# Altium schematic sheet Front-end.SchDoc
size A4
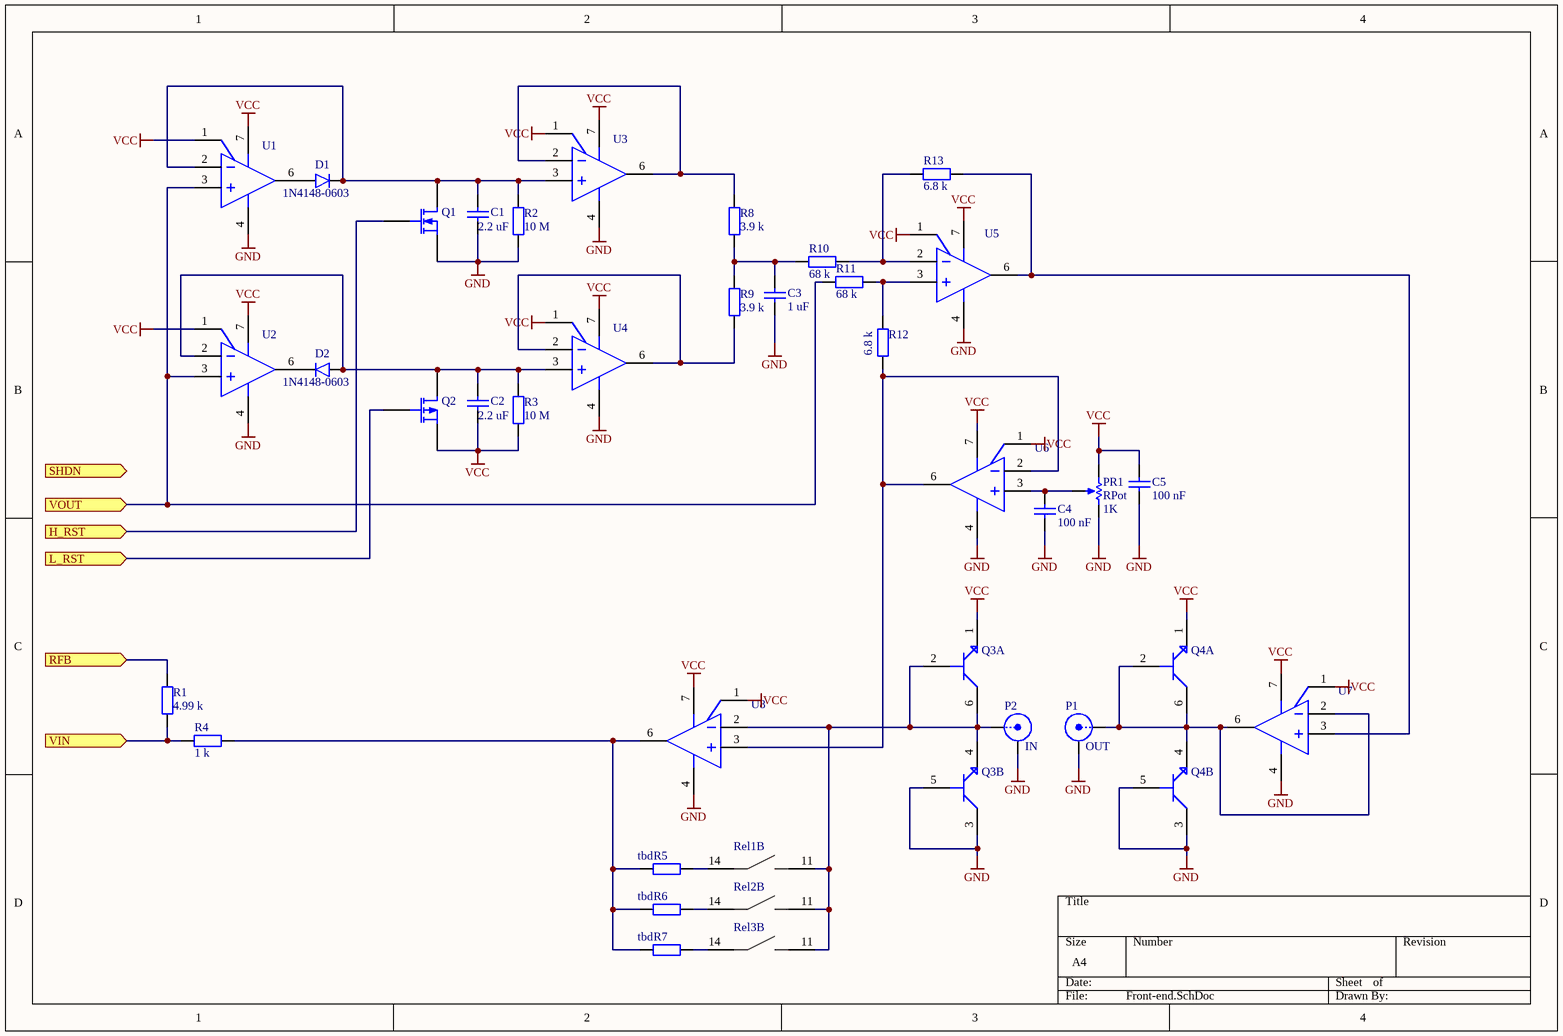
[diagram p0: Front-end.SchDoc]

## Parts
C1  2.2 uF  [C1206]
C2  2.2 uF  [C1206]
C3  1 uF  [C1206]
C4  100 nF  [C1206]
C5  100 nF  [C1206]
D1  1N4148-0603  [C1206]
D2  1N4148-0603  [C1206]
P1  OUT  [BNC_RA]
P2  IN  [BNC_RA]
PR1  RPot  value 1K  [TrimmPot]
Q1  MOSFET-N  [E3]  (value not drawn)
Q2  MOSFET-P  [E3]  (value not drawn)
Q3  MBT3904DW1T1G  (value not drawn)  (parts A,B of 2)
Q4  MBT3904DW1T1G  (value not drawn)  (parts A,B of 2)
R1  4.99 k  [R1206]
R2  10 M  [R1206]
R3  10 M  [R1206]
R4  1 k  [R1206]
R5  tbd  [R1206]
R6  tbd  [R1206]
R7  tbd  [R1206]
R8  3.9 k  [R1206]
R9  3.9 k  [R1206]
R10  68 k  [R1206]
R11  68 k  [R1206]
R12  6.8 k  [R1206]
R13  6.8 k  [R1206]
Rel1  RM45N-3021-85-xxxx  [RM45N-3021-85-xxxx]  (value not drawn)  (part B of 2)
Rel2  RM45N-3021-85-xxxx  [RM45N-3021-85-xxxx]  (value not drawn)  (part B of 2)
Rel3  RM45N-3021-85-xxxx  [RM45N-3021-85-xxxx]  (value not drawn)  (part B of 2)
U1  MAX4238  [NSO8_L]  (value not drawn)
U2  MAX4238  [NSO8_L]  (value not drawn)
U3  MAX4238  [NSO8_L]  (value not drawn)
U4  MAX4238  [NSO8_L]  (value not drawn)
U5  MAX4238  [NSO8_L]  (value not drawn)
U6  MAX4238  [NSO8_L]  (value not drawn)
U7  MAX4238  [NSO8_L]  (value not drawn)
U8  MAX4238  [NSO8_L]  (value not drawn)

## Ports
H_RST, L_RST, RFB, SHDN, VIN, VOUT

## Nets
GND: C1.1 C3.1 C4.1 C5.1 P1.2(Y) P2.2(Y) PR1.2(BOT) Q1.3(S) Q3.3 Q3.5 Q4.3 Q4.5 R2.1 U1.4 U2.4 U3.4 U4.4 U5.4 U6.4 U7.4 U8.4
VCC: C2.1 C5.2 PR1.1(TOP) Q2.3(S) Q3.1 Q4.1 R3.1 U1.1(SHDN) U1.7 U2.1(SHDN) U2.7 U3.1(SHDN) U3.7 U4.1(SHDN) U4.7 U5.1(SHDN) U5.7 U6.1(SHDN) U6.7 U7.1(SHDN) U7.7 U8.1(SHDN) U8.7
H_RST: Q1.2(G) ; port H_RST
L_RST: Q2.2(G) ; port L_RST
RFB: R1.2 ; port RFB
VIN: R1.1 R4.2 ; port VIN
VOUT: R11.2 U1.3(+) U2.3(+) ; port VOUT
NetC1_2: C1.2 D1.1 Q1.1(D) R2.2 U1.2(-) U3.3(+)
NetC2_2: C2.2 D2.2 Q2.1(D) R3.2 U2.2(-) U4.3(+)
NetC3_2: C3.2 R8.1 R9.2 R10.2
NetC4_2: C4.2 PR1.3(TAP) U6.3(+)
NetD1_2: D1.2 U1.6
NetD2_1: D2.1 U2.6
NetP1_1: P1.1(X) Q4.2 Q4.4 Q4.6 U7.2(-) U7.6
NetP2_1: P2.1(X) Q3.2 Q3.4 Q3.6 Rel1.11(SW) Rel2.11(SW) Rel3.11(SW) U8.2(-)
NetR4_1: R4.1 R5.2 R6.2 R7.2 U8.6
NetR5_1: R5.1 Rel1.14(SW)
NetR6_1: R6.1 Rel2.14(SW)
NetR7_1: R7.1 Rel3.14(SW)
NetR8_2: R8.2 U3.2(-) U3.6
NetR9_1: R9.1 U4.2(-) U4.6
NetR10_1: R10.1 R13.2 U5.2(-)
NetR11_1: R11.1 R12.1 U5.3(+)
NetR12_2: R12.2 U6.2(-) U6.6 U8.3(+)
NetR13_1: R13.1 U5.6 U7.3(+)

## Library data of the parts
C1 C2 = Cap Semi: Capacitor (Semiconductor SIM Model); Value: 2u2; Published: 8-Jun-2000; LatestRevisionDate: 29-May-2009; LatestRevisionNote: IPC-7351 Footprint Added.; PackageReference: C1206; Publisher: Altium Limited; PackageDescription: Chip Capacitor
C3 = Cap Semi: Capacitor (Semiconductor SIM Model); Value: 1u; Published: 8-Jun-2000; LatestRevisionDate: 29-May-2009; LatestRevisionNote: IPC-7351 Footprint Added.; PackageReference: C1206; Publisher: Altium Limited; PackageDescription: Chip Capacitor
C4 C5 = Cap Semi: Capacitor (Semiconductor SIM Model); Value: 100n; Published: 8-Jun-2000; LatestRevisionDate: 29-May-2009; LatestRevisionNote: IPC-7351 Footprint Added.; PackageReference: C1206; Publisher: Altium Limited; PackageDescription: Chip Capacitor
D1 D2 = 1N4148: Dioda: przełączająca; SMD; 100V; 150mA; 4ns; 0603; Manufacture: DC COMPONENTS; Shop1: TME; DafaultFootprint: 0603; Value1: 75V; Parameter1: Vr; Parameter2: If; ComponentLink1URL: http://www.tme.eu/pl/Document/56f18f971963fb7c3e40973a6fd3d82c/CD4148W_WT.pdf; ComponentLink2URL: *; ComponentLink1Description: Datasheet; ComponentLink2Description: *; Tolerance1: *; Shop1ID: *; ComponentType: Diod Rectifier; Assembly: SMD; Replacement: *; ComponentSymbol: 1N4148-0603; Value2: 150mA
P1 P2 = BNC: BNC Elbow Connector; LatestRevisionDate: 17-Jul-2002; LatestRevisionNote: Re-released for DXP Platform.; Publisher: Altium Limited
PR1 = RPot: Potentiometer; Sim Note: Enter the Resistance value and the set point into parameter fields.; Set Position: 0.5; Published: 8-Jun-2000; LatestRevisionDate: 17-Jul-2002; LatestRevisionNote: Re-released for DXP Platform.; PackageReference: VR5; Publisher: Altium Limited; PackageDescription: Variable Resistor, Thru-Hole; 3 Leads
Q1 = MOSFET-N: N-Channel MOSFET; Published: 8-Jun-2000; LatestRevisionDate: 17-Jul-2002; LatestRevisionNote: Re-released for DXP Platform.; PackageVersion: 1995/1996; PackageReference: E3; Publisher: Altium Limited; PackageDescription: TO, Flat Index; 3 In-Line, Axial Leads; Body Dia. 4.6mm; Lead Dia. 0.5 mm (max)
Q2 = MOSFET-P: P-Channel MOSFET; Published: 8-Jun-2000; LatestRevisionDate: 17-Jul-2002; LatestRevisionNote: Re-released for DXP Platform.; PackageVersion: 1995/1996; PackageReference: E3; Publisher: Altium Limited; PackageDescription: TO, Flat Index; 3 In-Line, Axial Leads; Body Dia. 4.6mm; Lead Dia. 0.5 mm (max)
R1 = Res2: Resistor; Value: 4k99; Published: 8-Jun-2000; LatestRevisionDate: 17-Jul-2002; LatestRevisionNote: Re-released for DXP Platform.; PackageReference: AXIAL-0.4; Publisher: Altium Limited; PackageDescription: Axial Device, Thru-Hole; 2 Leads; 0.4 in Pin Spacing
R2 R3 = Res2: Resistor; Value: 10M; Published: 8-Jun-2000; LatestRevisionDate: 17-Jul-2002; LatestRevisionNote: Re-released for DXP Platform.; PackageReference: AXIAL-0.4; Publisher: Altium Limited; PackageDescription: Axial Device, Thru-Hole; 2 Leads; 0.4 in Pin Spacing
R4 = Res2: Resistor; Value: 1k; Published: 8-Jun-2000; LatestRevisionDate: 17-Jul-2002; LatestRevisionNote: Re-released for DXP Platform.; PackageReference: AXIAL-0.4; Publisher: Altium Limited; PackageDescription: Axial Device, Thru-Hole; 2 Leads; 0.4 in Pin Spacing
R5-R7 = Res2: Resistor; Value: 1K; Published: 8-Jun-2000; LatestRevisionDate: 17-Jul-2002; LatestRevisionNote: Re-released for DXP Platform.; PackageReference: AXIAL-0.4; Publisher: Altium Limited; PackageDescription: Axial Device, Thru-Hole; 2 Leads; 0.4 in Pin Spacing
R8 R9 = Res2: Resistor; Value: 3k9; Published: 8-Jun-2000; LatestRevisionDate: 17-Jul-2002; LatestRevisionNote: Re-released for DXP Platform.; PackageReference: AXIAL-0.4; Publisher: Altium Limited; PackageDescription: Axial Device, Thru-Hole; 2 Leads; 0.4 in Pin Spacing
R10 R11 = Res2: Resistor; Value: 68k; Published: 8-Jun-2000; LatestRevisionDate: 17-Jul-2002; LatestRevisionNote: Re-released for DXP Platform.; PackageReference: AXIAL-0.4; Publisher: Altium Limited; PackageDescription: Axial Device, Thru-Hole; 2 Leads; 0.4 in Pin Spacing
R12 R13 = Res2: Resistor; Value: 6k8; Published: 8-Jun-2000; LatestRevisionDate: 17-Jul-2002; LatestRevisionNote: Re-released for DXP Platform.; PackageReference: AXIAL-0.4; Publisher: Altium Limited; PackageDescription: Axial Device, Thru-Hole; 2 Leads; 0.4 in Pin Spacing
U1-U8 = MAX4298/4299